# EAGLE board bmsmot (EAGLE 4.13), part 1 of 2
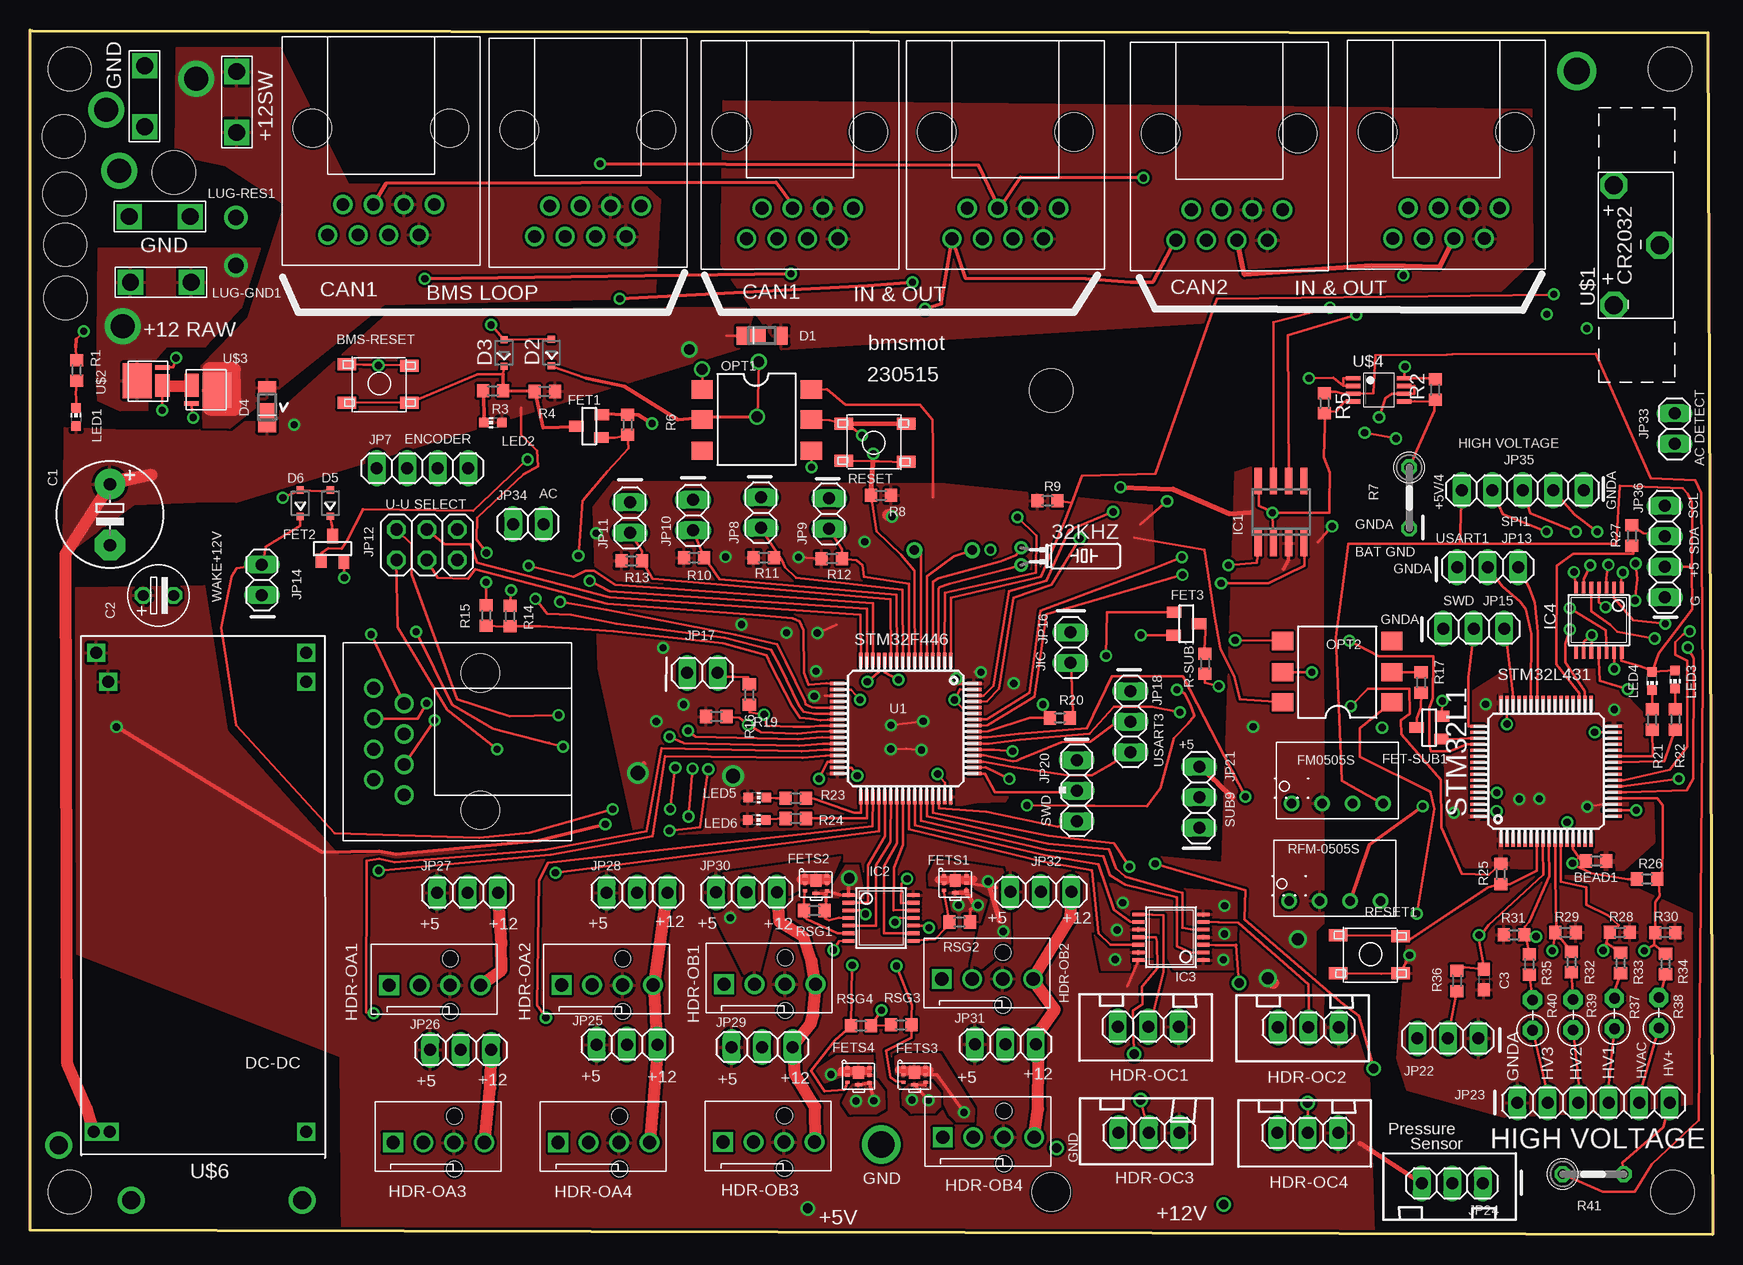
[diagram p2: board, top side]
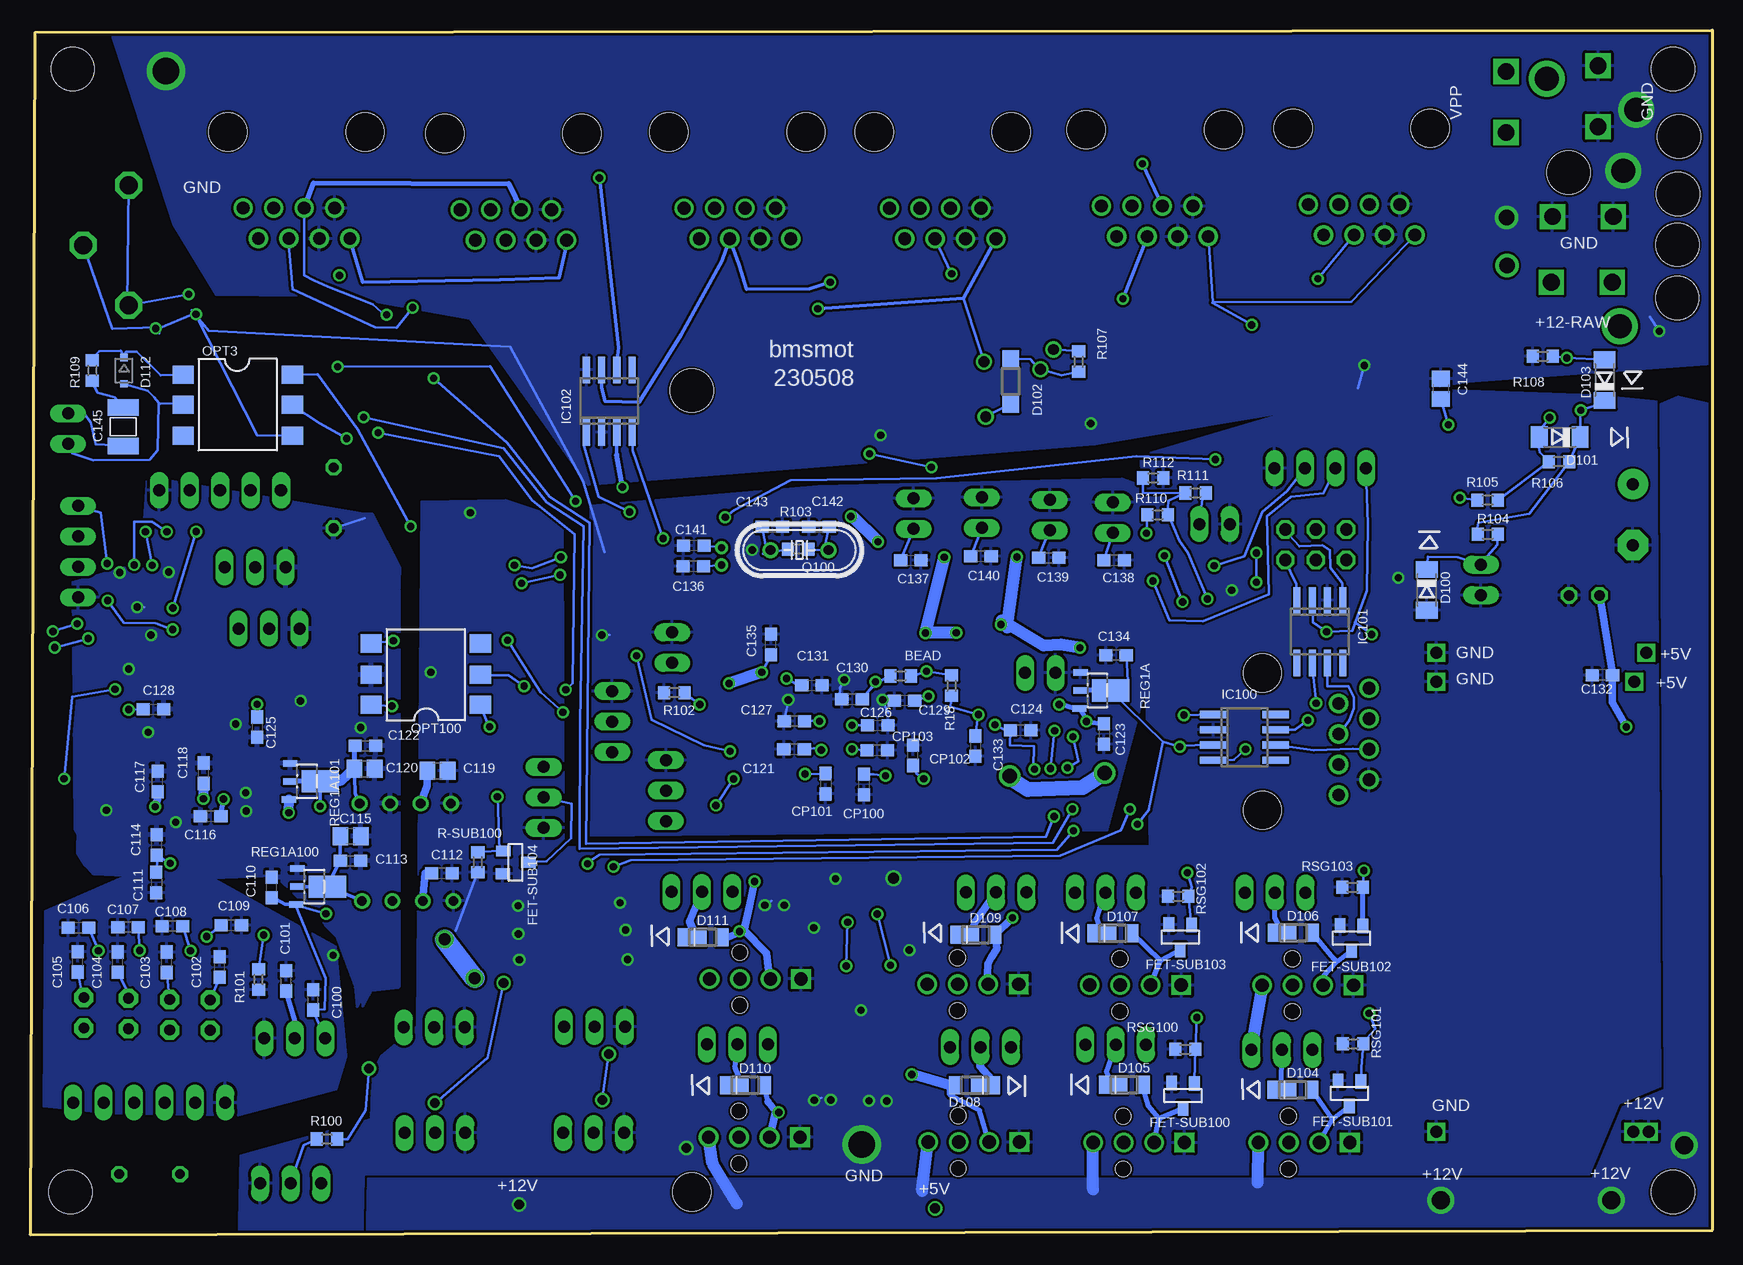
[diagram p3: board, bottom side, seen from below]

Size 140.27 x 100.39 mm. Coordinates in mm from the lower left corner, seen from the top.
Outline: 0,100.39 0,0.39 140.27,0 139.87,100.18 0.16,100.33
Copper layers (1*16): Top 0.035mm / dielectric 1.5mm / Bottom 0.035mm
Design rules "default": minimum track width 8mil, minimum drill 0.6mm, track to track 8mil, track to pad 8mil, pad to pad 8mil, via to via 8mil, smd to smd 0mil, copper to edge 8mil, drill to drill 8mil, minimum pad ring 10mil, minimum via ring 8mil, stop-mask expansion 4mil, vias tented up to drill 0mil, thermal gap 10mil
Holes 3.6 mm at 2.94,82.49 2.96,78.05 3.31,3.54 136.91,3.54 136.71,97.14 3.31,97.14 85.11,70.34 2.81,91.51 12.01,88.51 2.88,86.73
Holes 3.2 mm at 85.11,3.54

## Footprints (pad centres in the part's own frame; a part is rotated, then mirrored left to right if it is on the bottom)
32KHZ = drill 0.6 round: 1 -0.67,-3.1; 2 0.77,-3.1
SPADE_TAB = drill 1.4 square: G1 -2.54,0; G2 2.54,0
R0603 = smd 1 x 1.1: 1 -0.85,0; 2 0.85,0
E-SWITCH2 = smd 1.55 x 1: 1 -2.7,1.6; 2 2.5,1.5; 3 2.5,-1.6; 4 -2.7,-1.6
E5-8,5 = drill 1.016 pad 2.54 round: + -2.54,0 | drill 1.016 pad 2.54 octagon: - 2.54,0
ES-2,5L = drill 0.889 pad 1.27 octagon: 1 0,0; 2 2.54,0
C0603 = smd 1.1 x 1: 1 -0.85,0; 2 0.85,0
C0805 = smd 1.3 x 1.5: 1 -0.85,0; 2 0.85,0
1210 = smd 1.397 x 2.591: 1 -1.6,0; 2 1.6,0
POWERDI123 = smd 1.1 x 1.5: A 1,0 | smd 2.4 x 1.5: C -1.5,0
SOD323-R = smd 0.6 x 0.6: A 1.1,0; C -1.1,0
SOD80C = smd 1.4 x 1.8: A 1.7,0; C -1.7,0
SOD123 = smd 1.4 x 1.4: A 1.9,0; C -1.9,0
SOT-23 = smd 0.9 x 1.2: 1 -1,-1.006; 2 0.9,-1.056; 3 -0.05,1.056
DFN2020-6 = smd 0.33 x 0.25: D1 -0.925,0.4; D2 -0.925,-0.225; D5 0.925,-0.225; D6 0.925,0.4; G -0.925,-0.825; S1 0.925,-0.85 | smd 0.9 x 1.05: D7 0,0 | smd 0.56 x 0.25: S2 0,-1.05
DC-DC = drill 0.8 round: 1-GND 0,-1.27; 2-VIN 2.54,-1.27; 3-0V 5.08,-1.27; 4-VO 7.62,-1.27
1X4-MOLEXKK = drill 1.1 square: 1 3.81,0 | drill 1.1 round: 2 1.27,0; 3 -1.27,0; 4 -3.81,0 | hole 1.3: -1.3,2.2; -1.3,-2.2
1X03 = drill 1 long: 1 -2.54,0; 2 0,0; 3 2.54,0
SO-08 = smd 0.6 x 2.2: 1 -1.905,-2.6; 2 -0.635,-2.6; 3 0.635,-2.6; 4 1.905,-2.6; 5 1.905,2.6; 6 0.635,2.6; 7 -0.635,2.6; 8 -1.905,2.6
TSSOP14 = smd 0.305 x 0.991: 1 -1.905,-2.718; 2 -1.27,-2.718; 3 -0.635,-2.718; 4 0,-2.718; 5 0.635,-2.718; 6 1.27,-2.718; 7 1.905,-2.718; 8 1.905,2.718; 9 1.27,2.718; 10 0.635,2.718; 11 0,2.718; 12 -0.635,2.718; 13 -1.27,2.718; 14 -1.905,2.718
MOD8P8C = drill 1.067 pad 1.397 round: 1 -3.81,-2.54; 2 -2.54,0; 3 -1.27,-2.54; 4 0,0; 5 1.27,-2.54; 6 2.54,0; 7 3.81,-2.54; 8 5.08,0 | hole 3.175: -5.08,-8.89; 6.35,-8.89
1X04 = drill 1 long: 1 -3.81,0; 2 -1.27,0; 3 1.27,0; 4 3.81,0
1X02 = drill 1 long: 1 -1.27,0; 2 1.27,0
2X03 = drill 1.016 octagon: 1 -2.54,-1.27; 2 -2.54,1.27; 3 0,-1.27; 4 0,1.27; 5 2.54,-1.27; 6 2.54,1.27
1X06 = drill 1 long: 1 -6.35,0; 2 -3.81,0; 3 -1.27,0; 4 1.27,0; 5 3.81,0; 6 6.35,0
1X05 = drill 1.016 long: 1 -5.08,0; 2 -2.54,0; 3 0,0; 4 2.54,0; 5 5.08,0
CHIP-LED0603 = smd 0.8 x 0.8: A 0,-0.75; C 0,0.75
SMD-6 = smd 1.52 x 1.78: P$1 -2.5,-4.5; P$2 0,-4.5; P$3 2.6,-4.5; P$4 2.6,4.6; P$5 0,4.6; P$6 -2.5,4.6
HC49/S = drill 0.813 round: 1 -2.413,0; 2 2.413,0
0207/5V = drill 0.813 octagon: 1 -2.54,0; 2 2.54,0
RS-2,5 = drill 0.889 pad 1.6 octagon: 1 0,0; 2 2.54,0
SOT89 = smd 0.55 x 1.2: 1 -1.5,-1.4; 2 0,-1.4; 3 1.5,-1.5 | smd 1.85 x 3.1: 4 0,1.1
TQFP64 = smd 1.2 x 0.26: 1 -5.7,3.75; 2 -5.7,3.25; 3 -5.7,2.75; 4 -5.7,2.25; 5 -5.7,1.75; 6 -5.7,1.25; 7 -5.7,0.75; 8 -5.7,0.25; 9 -5.7,-0.25; 10 -5.7,-0.75; 11 -5.7,-1.25; 12 -5.7,-1.75; 13 -5.7,-2.25; 14 -5.7,-2.75; 15 -5.7,-3.25; 16 -5.7,-3.75; 33 5.7,-3.75; 34 5.7,-3.25; 35 5.7,-2.75; 36 5.7,-2.25; 37 5.7,-1.75; 38 5.7,-1.25; 39 5.7,-0.75; 40 5.7,-0.25; 41 5.7,0.25; 42 5.7,0.75; 43 5.7,1.25; 44 5.7,1.75; 45 5.7,2.25; 46 5.7,2.75; 47 5.7,3.25; 48 5.7,3.75 | smd 0.26 x 1.2: 17 -3.75,-5.7; 18 -3.25,-5.7; 19 -2.75,-5.7; 20 -2.25,-5.7; 21 -1.75,-5.7; 22 -1.25,-5.7; 23 -0.75,-5.7; 24 -0.25,-5.7; 25 0.25,-5.7; 26 0.75,-5.7; 27 1.25,-5.7; 28 1.75,-5.7; 29 2.25,-5.7; 30 2.75,-5.7; 31 3.25,-5.7; 32 3.75,-5.7; 49 3.75,5.7; 50 3.25,5.7; 51 2.75,5.7; 52 2.25,5.7; 53 1.75,5.7; 54 1.25,5.7; 55 0.75,5.7; 56 0.25,5.7; 57 -0.25,5.7; 58 -0.75,5.7; 59 -1.25,5.7; 60 -1.75,5.7; 61 -2.25,5.7; 62 -2.75,5.7; 63 -3.25,5.7; 64 -3.75,5.7
COIN = drill 1.5 pad 1.6 octagon: 1 -5.01,3.8; 2 5.01,3.8; 3 0.01,0
DFN3333-8L = smd 2.4 x 2.9: D -0.9,0.05 | smd 1.2 x 0.4: G 1.207,1.16 | smd 1.2 x 1.9: S 1.2,-0.35
VSSOP8 = smd 0.35 x 1.2: 1 -1.025,-2.125; 2 -0.375,-2.125; 3 0.275,-2.125; 4 0.925,-2.125; 5 0.925,2.125; 6 0.275,2.125; 7 -0.375,2.125; 8 -1.025,2.125
LM2569SW2 = drill 1 square: 1 0,16.4; 2 0,0; 3 37.5,0; 4 37.5,16.5; 11 0,17.7; 33 39.9,0; 44 39.9,17.5

## Placement (x,y rotation side)
32KHZ  X100  [32KHZ]  85.72,56.57 270 top
+12SW  +12-switched  [SPADE_TAB]  17.23,94.39 90 top
BEAD  1500  [R0603]  67.7,46.56 180 bottom
BEAD1  1  [R0603]  130.55,31.14 180 top
BMS-RESET  E-SWITCH2  [E-SWITCH2]  29.12,70.92 0 top
C1  100u 25v  [E5-8,5]  6.66,60 270 top
C2  10@25V  [ES-2,5L]  9.44,53.27 0 top
C3  .33u  [C0603]  121.2,21.26 270 top
C100  100n  [C0603]  116.65,19.57 90 bottom
C101  0.1u  [C0603]  118.91,21.15 90 bottom
C102  50n  [C0603]  124.46,22.31 90 bottom
C103  50n  [C0603]  128.87,22.7 90 bottom
C104  50n  [C0603]  132.94,22.71 90 bottom
C105  50n  [C0603]  136.28,22.74 90 bottom
C106  .33u  [C0603]  136.22,25.57 180 bottom
C107  .33u  [C0603]  132.09,25.62 180 bottom
C108  .33u  [C0603]  128.39,25.71 180 bottom
C109  .33u  [C0603]  123.49,25.8 0 bottom
C110  4.7u  [C0603]  120.11,28.93 90 bottom
C111  100n  [C0603]  129.74,29.35 270 bottom
C112  100n  [C0603]  105.94,30.13 0 bottom
C113  0.1u 25v  [C0603]  113.55,31.16 0 bottom
C114  1u  [C0603]  129.7,32.47 90 bottom
C115  4.7u 25v  [C0805]  113.54,33.22 0 bottom
C116  4.7u  [C0603]  125.21,34.86 180 bottom
C117  100n  [C0603]  129.63,37.77 90 bottom
C118  100n  [C0603]  125.79,38.45 90 bottom
C119  4.7  [C0805]  106.31,38.66 0 bottom
C120  4.7u 25v  [C0805]  112.39,38.84 0 bottom
C121  100n  [C0603]  76.58,40.44 180 bottom
C122  0.1u 25v  [C0603]  112.32,40.73 0 bottom
C123  4.7u  [C0603]  50.73,41.72 270 bottom
C124  4.7u 6.3v  [C0603]  57.68,42.05 0 bottom
C125  100n  [C0603]  121.35,42.29 270 bottom
C126  100n  [C0603]  69.6,42.44 0 bottom
C127  1u  [C0603]  76.55,42.79 180 bottom
C128  100n  [C0603]  129.97,43.79 0 bottom
C129  100n  [C0603]  67.37,44.49 180 bottom
C130  100n  [C0603]  71.75,44.6 180 bottom
C131  100n  [C0603]  75.09,45.77 0 bottom
C132  4.7u  [C0603]  9.2,46.64 180 bottom
C133  100n  [C0603]  61.46,40.71 270 bottom
C134  1u 25v  [C0603]  49.74,48.29 180 bottom
C135  100n  [C0603]  78.51,49.18 90 bottom
C136  10p  [C0603]  84.98,55.69 180 bottom
C137  100n  [C0603]  66.84,56.2 0 bottom
C138  100n  [C0603]  49.9,56.22 0 bottom
C139  100n  [C0603]  55.34,56.4 0 bottom
C140  100n  [C0603]  61,56.55 0 bottom
C141  10p  [C0603]  84.94,57.42 180 bottom
C142  15p  [C0603]  74.5,58.98 180 bottom
C143  15p  [C0603]  78.38,59 0 bottom
C144  4.7u  [C0805]  22.65,70.48 90 bottom
C145  [1210]  132.49,67.33 90 bottom
CP100  2.2u  [C0603]  70.77,37.51 270 bottom
CP101  2.2u  [C0603]  73.95,37.58 270 bottom
CP102  4.7u  [C0603]  66.66,39.94 90 bottom
CP103  4.7u  [C0603]  69.64,40.39 0 bottom
D1  Siicon diode  [POWERDI123]  61.61,74.93 0 top
D2  [SOD323-R]  43.46,73.51 90 top
D3  [SOD323-R]  39.51,73.48 90 top
D4  SBR3U60  [POWERDI123]  19.77,69.57 90 top
D5  [SOD323-R]  25.04,60.96 90 top
D6  [SOD323-R]  22.53,60.95 90 top
D100  MMS4687  [SOD80C]  23.83,53.73 270 bottom
D101  MMSZ4699  [SOD80C]  12.76,66.46 180 bottom
D102  1N4448  [SOD123]  58.52,71.11 270 bottom
D103  MMSZ4699  [SOD80C]  9.02,71.22 90 bottom
D104  SBR3U60  [POWERDI123]  34.41,12.08 0 bottom
D105  SBR3U60  [POWERDI123]  48.48,12.49 0 bottom
D106  SBR3U60  [POWERDI123]  34.39,25.16 0 bottom
D107  SBR3U60  [POWERDI123]  49.42,25.11 0 bottom
D108  SBR3U60  [POWERDI123]  62.12,12.46 180 bottom
D109  SBR3U60  [POWERDI123]  60.85,24.99 0 bottom
D110  SBR3U60  [POWERDI123]  80.06,12.46 0 bottom
D111  SBR3U60  [POWERDI123]  83.59,24.79 0 bottom
D112  [SOD323-R]  132.43,72 270 bottom
FET1  NFET  [SOT-23]  46.61,67.43 90 top
FET2  NFET  [SOT-23]  25.27,57.17 0 top
FET3  NFET  [SOT-23]  96.39,50.86 270 top
FET-SUB1  NFET  [SOT-23]  116.64,42.31 90 top
FET-SUB100  NFET  [SOT-23]  44.2,11.58 180 bottom
FET-SUB101  NFET  [SOT-23]  30.33,11.77 180 bottom
FET-SUB102  NFET  [SOT-23]  30.16,24.72 180 bottom
FET-SUB103  NFET  [SOT-23]  44.44,24.79 180 bottom
FET-SUB104  NFET  [SOT-23]  99.8,30.98 270 bottom
FETS1  BUK6D  [DFN2020-6]  77.12,29.53 0 top
FETS2  BUK6D  [DFN2020-6]  65.51,29.5 0 top
FETS3  BUK6D  [DFN2020-6]  73.72,13.54 0 top
FETS4  BUK6D  [DFN2020-6]  69.06,13.53 0 top
FM0505S  DC-DC  [DC-DC]  105.17,37.21 0 top
GND  GND  [SPADE_TAB]  9.56,94.87 90 top
HDR-OA1  PINHD-1X4-MOLEXKK  [1X4-MOLEXKK]  33.75,20.79 180 top
HDR-OA2  PINHD-1X4-MOLEXKK  [1X4-MOLEXKK]  48.12,20.8 180 top
HDR-OA3  PINHD-1X4-MOLEXKK  [1X4-MOLEXKK]  34.07,7.68 180 top
HDR-OA4  PINHD-1X4-MOLEXKK  [1X4-MOLEXKK]  47.84,7.68 180 top
HDR-OB1  PINHD-1X4-MOLEXKK  [1X4-MOLEXKK]  61.66,20.88 180 top
HDR-OB2  PINHD-1X4-MOLEXKK  [1X4-MOLEXKK]  79.81,21.31 180 top
HDR-OB3  PINHD-1X4-MOLEXKK  [1X4-MOLEXKK]  61.59,7.72 180 top
HDR-OB4  PINHD-1X4-MOLEXKK  [1X4-MOLEXKK]  79.89,8.11 180 top
HDR-OC1  SUBX3  [1X03]  93.22,17.33 0 top
HDR-OC2  SUBX2  [1X03]  106.57,17.27 0 top
HDR-OC3  SUBX4  [1X03]  93.28,8.49 0 top
HDR-OC4  SUBX1  [1X03]  106.52,8.49 0 top
IC1  MCP2551  [SO-08]  104.28,60.22 0 top
IC2  74125  [TSSOP14]  70.94,26.39 270 top
IC3  74VHCT125  [TSSOP14]  95.11,24.79 90 top
IC4  74125  [TSSOP14]  130.78,51.21 180 top
IC100  MCP2551  [SO-08]  39.04,41.45 270 bottom
IC101  MCP2551  [SO-08]  32.75,50.25 180 bottom
IC102  MCP2551  [SO-08]  91.99,69.46 0 bottom
JP1  [MOD8P8C]  29.9,83.31 180 top
JP2  [MOD8P8C]  47.14,83.18 180 top
JP3  [MOD8P8C]  118.69,83.01 180 top
JP4  [MOD8P8C]  64.82,83 180 top
JP5  [MOD8P8C]  81.94,83 180 top
JP6  [MOD8P8C]  100.61,82.87 180 top
JP7  Encoder  [1X04]  32.72,63.87 180 top
JP8  [1X02]  60.93,60.18 90 top
JP9  [1X02]  66.61,60.09 90 top
JP10  [1X02]  55.27,59.97 90 top
JP11  [1X02]  50.01,59.76 90 top
JP12  [2X03]  33.09,57.49 0 top
JP13  [1X03]  121.51,55.62 0 top
JP14  [1X02]  19.32,54.56 90 top
JP15  SWD  [1X03]  120.35,50.5 0 top
JP16  [1X02]  86.73,48.92 270 top
JP17  [1X02]  56.06,46.82 180 top
JP18  [1X03]  91.73,42.76 270 top
JP19  [MOD8P8C]  28.65,40.45 90 top
JP20  SWD  [1X03]  87.26,37 270 top
JP21  [1X03]  97.46,36.45 90 top
JP22  HALL-EFFECT  [1X03]  118.19,16.35 180 top
JP23  [1X06]  130.33,11 0 top
JP24  [1X03]  118.55,4.27 180 top
JP25  [1X03]  49.77,15.84 0 top
JP26  [1X03]  35.9,15.4 0 top
JP27  [1X03]  36.48,28.5 0 top
JP28  [1X03]  50.62,28.51 0 top
JP29  [1X03]  61.03,15.64 0 top
JP30  [1X03]  59.73,28.52 0 top
JP31  [1X03]  81.3,15.86 0 top
JP32  [1X03]  84.26,28.57 0 top
JP33  [1X02]  137.09,67.17 90 top
JP34  [1X02]  41.53,59.22 180 top
JP35  [1X05]  124.43,62.03 180 top
JP36  I2C  [1X04]  136.27,56.92 90 top
LED1  [CHIP-LED0603]  3.84,68.14 0 top
LED2  [CHIP-LED0603]  38.59,67.67 90 top
LED3  [CHIP-LED0603]  137.14,46.27 180 top
LED4  [CHIP-LED0603]  135.22,46.14 180 top
LED5  [CHIP-LED0603]  60.61,36.42 270 top
LED6  [CHIP-LED0603]  60.58,34.57 270 top
LUG-GND1  +12V-RAW  [SPADE_TAB]  10.91,79.37 0 top
LUG-RES1  GND  [SPADE_TAB]  10.82,84.84 180 top
OPT1  H11L1S  [SMD-6]  60.52,67.93 270 top
OPT2  H11L1S  [SMD-6]  109.02,46.88 90 top
OPT3  H11L1S  [SMD-6]  123,69.17 270 bottom
OPT100  H11L1S  [SMD-6]  107.23,46.66 90 bottom
Q100  [HC49/S]  76.13,57.05 180 bottom
R1  10K  [R0603]  3.89,72.03 270 top
R2  100K  [R0603]  117.14,70.42 90 top
R3  10K  [R0603]  38.6,70.32 0 top
R4  10K  [R0603]  42.9,70.27 180 top
R5  100K  [R0603]  107.9,69.29 270 top
R6  100K  [R0603]  49.82,67.49 90 top
R7  22M  [0207/5V]  114.96,61.4 270 top
R8  10K  [R0603]  70.94,61.61 0 top
R9  1M  [R0603]  84.81,61.16 180 top
R10  10K  [R0603]  55.35,56.41 0 top
R11  10K  [R0603]  61.18,56.41 0 top
R12  10K  [R0603]  66.84,56.33 0 top
R13  10K  [R0603]  50.15,56.15 0 top
R14  33K  [R0603]  40.02,51.56 90 top
R15  120K  [R0603]  38.03,51.6 90 top
R16  10K  [R0603]  59.96,45 90 top
R17  1.8K  [R0603]  115.96,46.02 90 top
R18  10K  [R0603]  63.45,45.75 270 bottom
R19  10K  [R0603]  57.22,43.18 0 top
R20  100K  [R0603]  85.85,43.06 0 top
R21  6.8K  [R0603]  135.22,42.92 270 top
R22  10K  [R0603]  137.15,42.93 270 top
R23  6.8K  [R0603]  63.83,36.37 0 top
R24  3.3K  [R0603]  63.83,34.69 0 top
R25  10K  [R0603]  122.6,30.05 270 top
R26  10K  [R0603]  134.79,29.64 180 top
R27  3.3k  [R0603]  133.53,58.25 270 top
R28  10K  [R0603]  132.52,25.2 0 top
R29  10K  [R0603]  127.99,25.19 0 top
R30  10K  [R0603]  136.31,25.17 0 top
R31  10K  [R0603]  123.7,24.99 180 top
R32  110K  [R0603]  128.49,22.71 90 top
R33  110K  [R0603]  132.59,22.64 90 top
R34  110K  [R0603]  136.34,22.57 90 top
R35  110K  [R0603]  124.98,22.53 90 top
R36  5.6K  [R0603]  118.94,21.15 90 top
R37  1M  [RS-2,5]  132.07,17.16 90 top
R38  1M  [RS-2,5]  135.78,17.22 90 top
R39  1M  [RS-2,5]  128.63,17.05 90 top
R40  1M  [RS-2,5]  125.25,17.03 90 top
R41  22M  [0207/5V]  130.3,5.05 0 top
R100  5.6K  [R0603]  115.52,7.97 180 bottom
R101  10K  [R0603]  121.21,21.26 270 bottom
R102  100K  [R0603]  86.56,45.17 0 bottom
R103  1M  [R0603]  76.23,57.13 0 bottom
R104  100K  [R0603]  18.75,58.36 0 bottom
R105  100K  [R0603]  18.76,61.21 180 bottom
R106  1M  [R0603]  12.82,64.42 180 bottom
R107  3.3K  [R0603]  52.86,72.75 270 bottom
R108  100K  [R0603]  14.17,73.2 180 bottom
R109  10K  [R0603]  135.08,72.01 90 bottom
R110  10K  [R0603]  46.27,59.99 180 bottom
R111  56K  [R0603]  43.12,61.81 180 bottom
R112  10K  [R0603]  46.64,63.06 0 bottom
R-SUB1  1.8K  [R0603]  97.94,47.58 270 top
R-SUB100  2M  [R0603]  102.94,31.04 270 bottom
REG1A  AP7380Y  [SOT89]  51.29,45.35 270 bottom
REG1A100  AP7380Y  [SOT89]  116.58,29 270 bottom
REG1A101  AP7380Y  [SOT89]  117.18,37.78 270 bottom
RESET  E-SWITCH2  [E-SWITCH2]  70.34,65.99 180 top
RESET1  E-SWITCH2  [E-SWITCH2]  111.74,23.37 0 top
RFM-0505S  DC-DC  [DC-DC]  104.97,29.08 0 top
RSG1  2M  [R0603]  65.39,27.01 0 top
RSG2  2M  [R0603]  77.49,26.05 0 top
RSG3  2M  [R0603]  72.61,17.49 180 top
RSG4  2M  [R0603]  69.27,17.41 0 top
RSG100  2M  [R0603]  43.96,15.45 180 bottom
RSG101  2M  [R0603]  29.98,15.9 180 bottom
RSG102  2M  [R0603]  44.55,28.2 180 bottom
RSG103  2M  [R0603]  30.03,28.95 180 bottom
STM32L1  STM32L431RXT6  [TQFP64]  126.37,38.61 90 top
U1  STM32F10XRXT6  [TQFP64]  73,42.18 270 top
U$1  COIN  [COIN]  135.84,82.46 90 top
U$2  PJQ4403P  [DFN3333-8L]  9.83,71.11 0 top
U$3  PJQ4403P  [DFN3333-8L]  14.68,70.43 180 top
U$4  TVL522  [VSSOP8]  112.43,70.35 270 top
U$6  LM2596-2  [LM2569SW2]  23.03,8.59 90 top